# EAGLE schematic adapterSchematic (EAGLE 9.6.2)
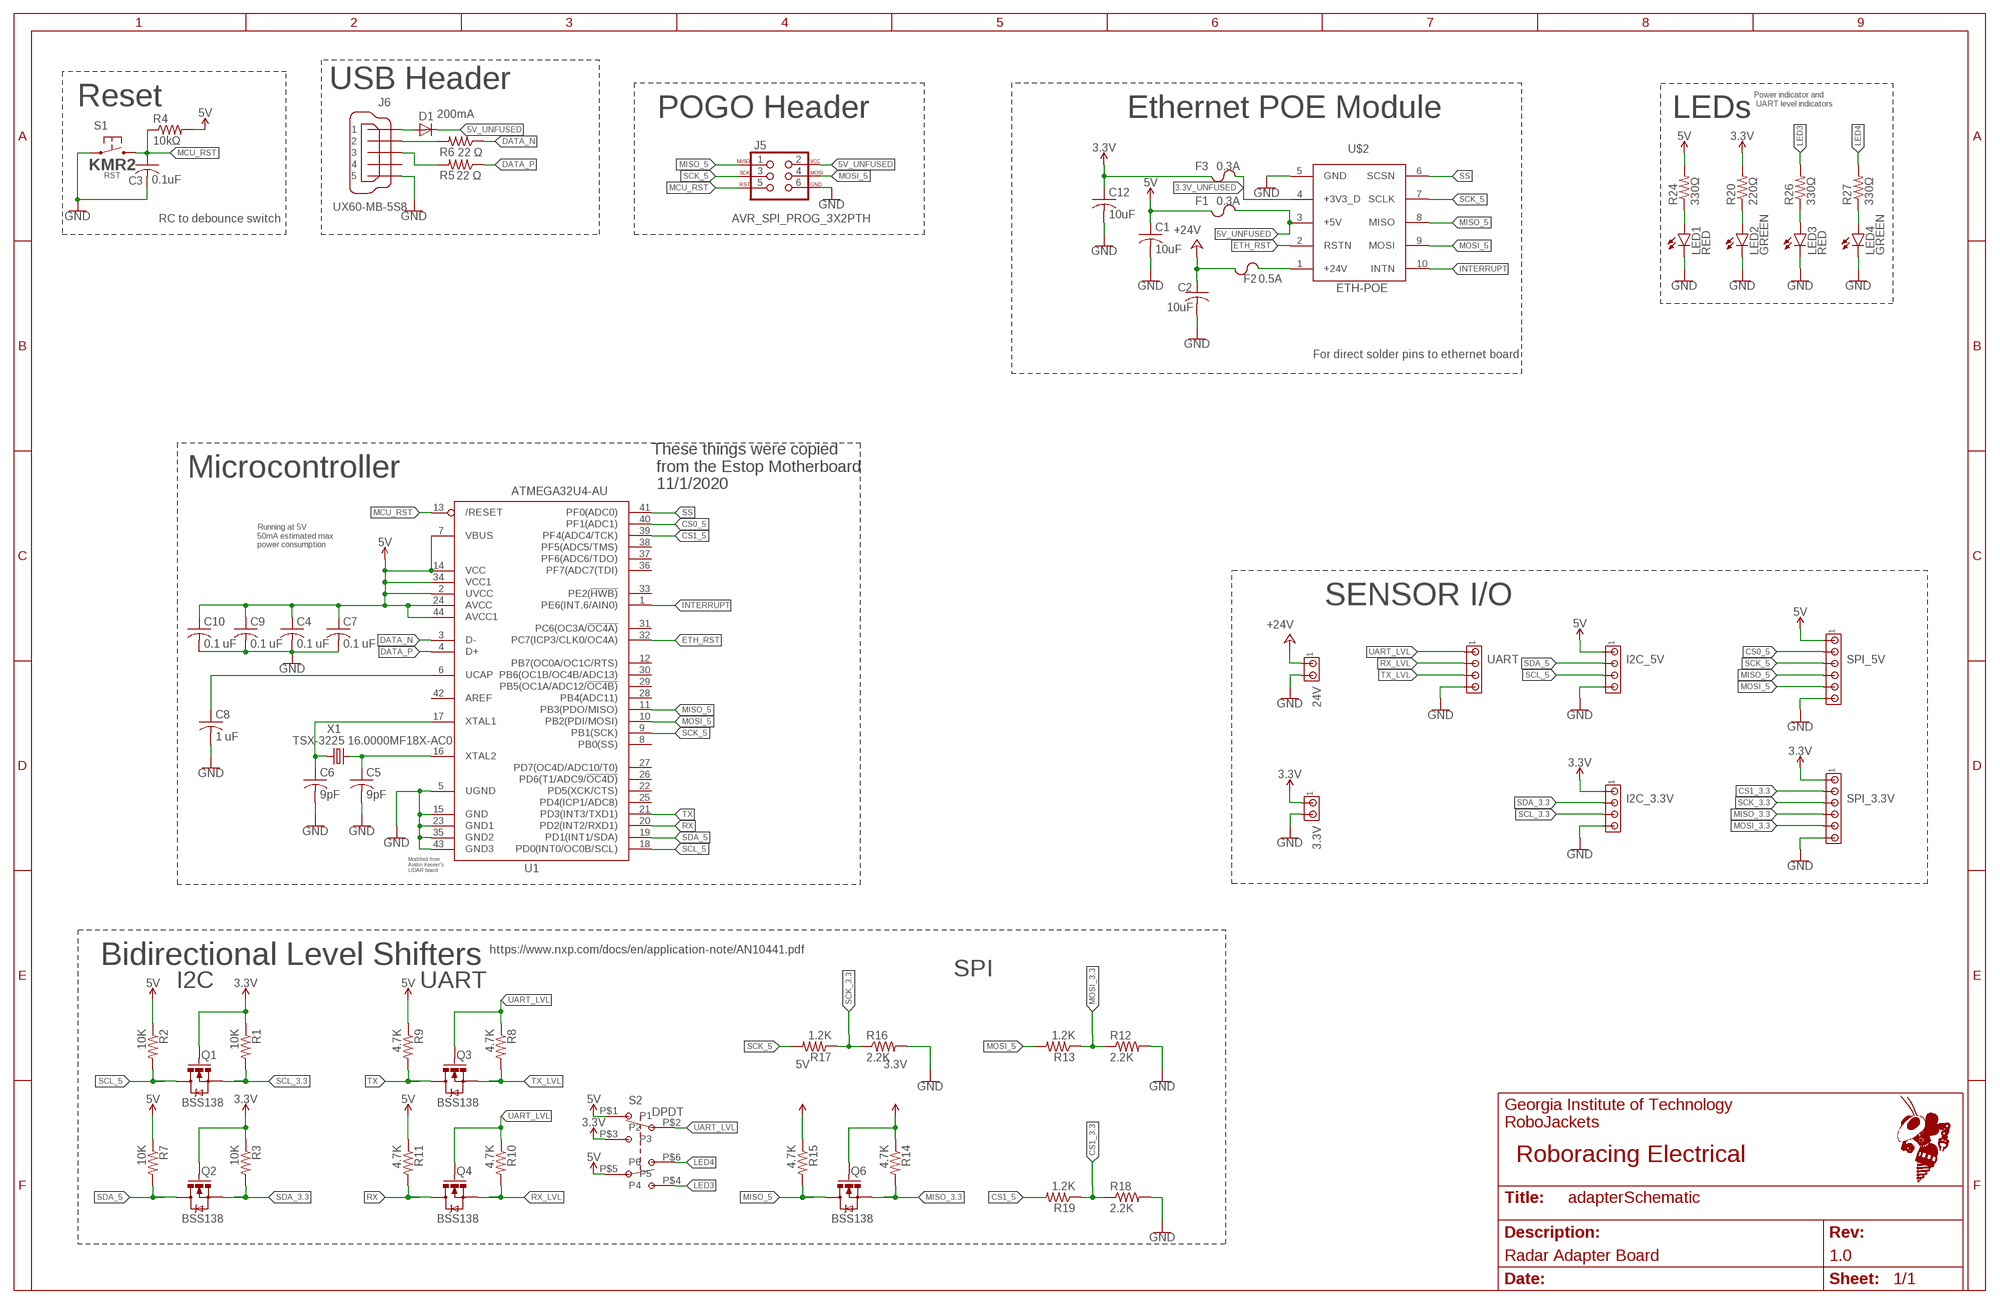
[diagram p0: schematic, sheet 1]
FRAME1 (FRAME_11_17): REVISION: 1.0; SCH_DESC: Radar Adapter Board; TEAM: Roboracing Electrical

## Parts
3.3V  MTA02-100  [10X02MTA]
24V  MTA02-100  [10X02MTA]
C1  10uF  C-USC1206  [C1206]
C2  10uF  C-USC1206  [C1206]
C3  0.1uF  C-USC0603  [C0603]
C4  0.1 uF  C-USC0603  [C0603]
C5  9pF  C-USC0603  [C0603]
C6  9pF  C-USC0603  [C0603]
C7  0.1 uF  C-USC0603  [C0603]
C8  1 uF  C-USC0603  [C0603]
C9  0.1 uF  C-USC0603  [C0603]
C10  0.1 uF  C-USC0603  [C0603]
C12  10uF  C-USC1206  [C1206]
D1  200mA  DIODE-SOD323-R  [SOD323-R]
F1  0.3A  CHIP_FUSE1206  [F1206]
F2  0.5A  CHIP_FUSE1206  [F1206]
F3  0.3A  CHIP_FUSE1206  [F1206]
I2C_3.3V  MTA04-100  [10X04MTA]
I2C_5V  MTA04-100  [10X04MTA]
J5  AVR_SPI_PROG_3X2PTH  [2X3]
J6  UX60-MB-5S8  [UX60-MB-5S8]
LED1  RED  LEDCHIP-LED0603  [CHIP-LED0603]
LED2  GREEN  LEDCHIP-LED0603  [CHIP-LED0603]
LED3  RED  LEDCHIP-LED0603  [CHIP-LED0603]
LED4  GREEN  LEDCHIP-LED0603  [CHIP-LED0603]
Q1  BSS138  MOSFET-NCHANNELSMD  [SOT23-3]
Q2  BSS138  MOSFET-NCHANNELSMD  [SOT23-3]
Q3  BSS138  MOSFET-NCHANNELSMD  [SOT23-3]
Q4  BSS138  MOSFET-NCHANNELSMD  [SOT23-3]
Q6  BSS138  MOSFET-NCHANNELSMD  [SOT23-3]
R1  10K  RESISTOR0603-RES  [0603-RES]
R2  10K  RESISTOR0603-RES  [0603-RES]
R3  10K  RESISTOR0603-RES  [0603-RES]
R4  10kΩ  R-US_R0603  [R0603]
R5  22 Ω  R-US_R0603  [R0603]
R6  22 Ω  R-US_R0603  [R0603]
R7  10K  RESISTOR0603-RES  [0603-RES]
R8  4.7K  RESISTOR0603-RES  [0603-RES]
R9  4.7K  RESISTOR0603-RES  [0603-RES]
R10  4.7K  RESISTOR0603-RES  [0603-RES]
R11  4.7K  RESISTOR0603-RES  [0603-RES]
R12  2.2K  RESISTOR0603-RES  [0603-RES]
R13  1.2K  RESISTOR0603-RES  [0603-RES]
R14  4.7K  RESISTOR0603-RES  [0603-RES]
R15  4.7K  RESISTOR0603-RES  [0603-RES]
R16  2.2K  RESISTOR0603-RES  [0603-RES]
R17  1.2K  RESISTOR0603-RES  [0603-RES]
R18  2.2K  RESISTOR0603-RES  [0603-RES]
R19  1.2K  RESISTOR0603-RES  [0603-RES]
R20  220Ω  R-US_R0603  [R0603]
R24  330Ω  R-US_R0603  [R0603]
R26  330Ω  R-US_R0603  [R0603]
R27  330Ω  R-US_R0603  [R0603]
S1  KMR2  [KMR2]
SPI_3.3V  MTA06-100  [10X06MTA]
SPI_5V  MTA06-100  [10X06MTA]
U1  ATMEGA32U4-AU  [TQFP44]
U$2  ETH-POE  [HDRVR10W64P4000X254_2X5_1016X508X254B]
U$4  DPDT_SLIDE_SWITCH  [DPDT_SLIDE_SWITCH]
UART  MTA04-100  [10X04MTA]
X1  TSX-3225 16.0000MF18X-AC0  XTAL-3.2X2.5  [XTAL-3.2X2.5]

## Nets
3.3V: 3.3V.1 C12.1 F3.1 I2C_3.3V.1 Q1.1(G) Q2.1(G) Q6.1(G) R1.1 R3.1 R14.1 R20.2 SPI_3.3V.1 U$4.P$3(P3)
3.3V_UNFUSED: F3.2 U$2.4(+3V3_D)
5V [power]: C1.1 C4.1 C7.1 C9.1 C10.1 F1.1 I2C_5V.1 R2.1 R4.2 R7.1 R9.1 R11.1 R15.1 R24.2 SPI_5V.1 U1.2(UVCC) U1.7(VBUS) U1.14(VCC) U1.24(AVCC) U1.34(VCC1) U1.44(AVCC1) U$4.P$1(P1) U$4.P$5(P5)
5V_UNFUSED [power]: D1.C F1.2 J5.2 U$2.3(+5V)
24V_UNFUSED: F2.2 U$2.1(+24V)
+24V: 24V.1 C2.1 F2.1
CS0_5: SPI_5V.2 U1.40(PF1(ADC1))
CS1_3.3: R18.1 R19.1 SPI_3.3V.2
CS1_5: R19.2 U1.39(PF4(ADC4/TCK))
DATA_N: R6.1 U1.3(D-)
DATA_P [RF]: R5.1 U1.4(D+)
ETH_RST: U1.32(PC7(ICP3/CLK0/OC4A)) U$2.2(RSTN)
GND [power]: 3.3V.2 24V.2 C1.2 C2.2 C3.2 C4.2 C5.2 C6.2 C7.2 C8.2 C9.2 C10.2 C12.2 I2C_3.3V.4 I2C_5V.4 J5.6 J6.5 LED1.C LED2.C LED3.C LED4.C R12.2 R16.2 R18.2 S1.1.1 S1.1.2 SPI_3.3V.6 SPI_5V.6 U1.5(UGND) U1.15(GND) U1.23(GND1) U1.35(GND2) U1.43(GND3) U$2.5(GND) UART.4
INTERRUPT: U1.1(PE6(INT.6/AIN0)) U$2.10(INTN)
LED3: R26.2 U$4.P$4(P4)
LED4: R27.2 U$4.P$6(P6)
MCU_RST: C3.1 J5.5 R4.1 S1.2.1 S1.2.2 U1.13(/RESET)
MISO_3.3: Q6.2(S) R14.2 SPI_3.3V.4
MISO_5: J5.1 Q6.3(D) R15.2 SPI_5V.4 U1.11(PB3(PDO/MISO)) U$2.8(MISO)
MOSI_3.3: R12.1 R13.1 SPI_3.3V.5
MOSI_5: J5.4 R13.2 SPI_5V.5 U1.10(PB2(PDI/MOSI)) U$2.9(MOSI)
N$1: LED2.A R20.1
N$3: LED1.A R24.1
N$4: LED3.A R26.1
N$5: J6.2 R6.2
N$7: D1.A J6.1
N$8: LED4.A R27.1
N$11: J6.3 R5.2
RX: Q4.3(D) R11.2 U1.20(PD2(INT2/RXD1))
RX_LVL: Q4.2(S) R10.2 UART.2
SCK_3.3: R16.1 R17.1 SPI_3.3V.3
SCK_5: J5.3 R17.2 SPI_5V.3 U1.9(PB1(SCK)) U$2.7(SCLK)
SCL_3.3: I2C_3.3V.3 Q1.2(S) R1.2
SCL_5: I2C_5V.3 Q1.3(D) R2.2 U1.18(PD0(INT0/OC0B/SCL))
SDA_3.3: I2C_3.3V.2 Q2.2(S) R3.2
SDA_5: I2C_5V.2 Q2.3(D) R7.2 U1.19(PD1(INT1/SDA))
SS: U1.41(PF0(ADC0)) U$2.6(SCSN)
TX: Q3.3(D) R9.2 U1.21(PD3(INT3/TXD1))
TX_LVL: Q3.2(S) R8.2 UART.3
UART_LVL: Q3.1(G) Q4.1(G) R8.1 R10.1 U$4.P$2(P2) UART.1
UCAP: C8.1 U1.6(UCAP)
XTAL1: C6.1 U1.17(XTAL1) X1.1
XTAL2: C5.1 U1.16(XTAL2) X1.3
Unconnected: J6.4 U1.8(PB0(SS)) U1.12(PB7(OC0A/OC1C/RTS)) U1.22(PD5(XCK/CTS)) U1.25(PD4(ICP1/ADC8)) U1.26(PD6(T1/ADC9/!OC4D)) U1.27(PD7(OC4D/ADC10/T0)) U1.28(PB4(ADC11)) U1.29(PB5(OC1A/ADC12/!OC4B)) U1.30(PB6(OC1B/OC4B/ADC13)) U1.31(PC6(OC3A/!OC4A)) U1.33(PE2(!HWB)) U1.36(PF7(ADC7(TDI)) U1.37(PF6(ADC6/TDO)) U1.38(PF5(ADC5/TMS)) U1.42(AREF)

## Notes on the sheet
- USB Header
- Reset
- Power indicator and
   UART level indicators
- POGO Header | Ethernet POE Module | LEDs
- RC to debounce switch
- For direct solder pins to ethernet board
- Microcontroller
- These things were copied
   from the Estop Motherboard 
   11/1/2020
- Running at 5V
  50mA estimated max
  power consumption
- SENSOR I/O
- Modified from 
  Austin Keener's 
  LIDAR board
- https://www.nxp.com/docs/en/application-note/AN10441.pdf
- Bidirectional Level Shifters
- SPI
- I2C | UART
- S2

## Library data of the parts
3.3V 24V = con-amp:MTA02-100: AMP connector
C1-C3 C12 = rcl:C-US: CAPACITOR, American symbol; SPICEPREFIX: C
C4-C10 = resistor:C-US: CAPACITOR, American symbol
D1 = RoboJackets-Diodes:DIODE-: DIODE
F1-F3 = RoboJackets-Fuses:CHIP_FUSE
I2C_3.3V I2C_5V UART = con-amp:MTA04-100: AMP connector
J5 = SparkFun-Connectors:AVR_SPI_PROG_3X2: AVR ISP 6 Pin This is the reduced ISP connector for AVR programming. Common on Arduino. This footprint will take up less PCB space and can be used with a 10-pin to 6-pin adapter such as SKU: BOB-08508 **Special note about "TEST_POINT" package. The stop mask is on the top side, so if you want your programming test points to be on the bottom of your board, make sure to place this package on the bottom side of the board. This also ensure that the orientation to program from the bottom side will be correct. SparkFun Products: SparkFun ISP Pogo Adapter <https://www.sparkfun.com/products/11591> - NS Tiny AVR Programmer <https://www.sparkfun.com/products/11801> -PTH
J6 = RoboJackets-Connectors:UX60*-MB-5S?: Mini USB Connector Brand: Hirose Electric Co Ltd <http://www.hirose.com/us/> Series: UX <http://www.digikey.com/product-search/en?FV=fff40016,fff802e4,ffec3225> Distributor: Digi-Key <http://www.digikey.com/product-detail/en/UX60A-MB-5ST/H2961CT-ND/597540>; PINS: 5
LED1-LED4 = led:LED: LED OSRAM: - CHIPLED LG R971, LG N971, LY N971, LG Q971, LY Q971, LO R971, LY R971 LH N974, LH R974 LS Q976, LO Q976, LY Q976 LO Q996 - Hyper CHIPLED LW Q18S LB Q993, LB Q99A, LB R99A - SideLED LS A670, LO A670, LY A670, LG A670, LP A670 LB A673, LV A673, LT A673, LW A673 LH A674 LY A675 LS A676, LA A676, LO A676, LY A676, LW A676 LS A679, LY A679, LG A679 - Hyper Micro SIDELED® LS Y876, LA Y876, LO Y876, LY Y876 LT Y87S - SmartLED LW L88C, LW L88S LB L89C, LB L89S, LG L890 LS L89K, LO L89K, LY L89K LS L896, LA L896, LO L896, LY L896 - TOPLED LS T670, LO T670, LY T670, LG T670, LP T670 LSG T670, LSP T670, LSY T670, LOP T670, LYG T670 LG T671, LOG T671, LSG T671 LB T673, LV T673, LT T673, LW T673 LH T674 LS T676, LA T676, LO T676, LY T676, LB T676, LH T676, LSB T676, LW T676 LB T67C, LV T67C, LT T67C, LS T67K, LO T67K, LY T67K, LW E67C LS E67B, LA E67B, LO E67B, LY E67B, LB E67C, LV E67C, LT E67C LW T67C LS T679, LY T679, LG T679 LS T770, LO T770, LY T770, LG T770, LP T770 LB T773, LV T773, LT T773, LW T773 LH T774 LS E675, LA E675, LY E675, LS T675 LS T776, LA T776, LO T776, LY T776, LB T776 LHGB T686 LT T68C, LB T68C - Hyper Mini TOPLED® LB M676 - Mini TOPLED Santana® LG M470 LS M47K, LO M47K, LY M47K Source: http://www.osram.convergy.de LUXEON: - LUMILED® LXK2-PW12-R00, LXK2-PW12-S00, LXK2-PW14-U00, LXK2-PW14-V00 LXK2-PM12-R00, LXK2-PM12-S00, LXK2-PM14-U00 LXK2-PE12-Q00, LXK2-PE12-R00, LXK2-PE12-S00, LXK2-PE14-T00, LXK2-PE14-U00 LXK2-PB12-K00, LXK2-PB12-L00, LXK2-PB12-M00, LXK2-PB14-N00, LXK2-PB14-P00, LXK2-PB14-Q00 LXK2-PR12-L00, LXK2-PR12-M00, LXK2-PR14-Q00, LXK2-PR14-R00 LXK2-PD12-Q00, LXK2-PD12-R00, LXK2-PD12-S00 LXK2-PH12-R00, LXK2-PH12-S00 LXK2-PL12-P00, LXK2-PL12-Q00, LXK2-PL12-R00 Source: www.luxeon.com KINGBRIGHT: KA-3528ASYC Source: www.kingbright.com
Q1-Q4 Q6 = SparkFun:MOSFET-NCHANNEL
R1-R3 R7-R19 = SparkFun:RESISTOR: Resistor Basic schematic elements and footprints for 0603, 1206, and PTH resistors.
R4-R6 R20 R24 R26 R27 = rcl:R-US_: RESISTOR, American symbol; SPICEPREFIX: R
S1 = RoboJackets-Switches:KMR2; FUNCTION: RST
SPI_3.3V SPI_5V = con-amp:MTA06-100: AMP connector Connection corrected 2014-09-19
U1 = estop-v1.0:ATMEGA32U4: http://www.ladyada.net/library/eagle
U$2 = ethernet_poe:ETH-POE: POE
U$4 = DPDT-slide-switch:DPDT_SLIDE_SWITCH
X1 = RoboJackets-FreqGen:XTAL

## Net classes
0 default: width 0.203 mm, drill 0.508 mm, clearance 0.178 mm
1 power: width 0.305 mm, drill 0.508 mm, clearance 0.178 mm
2 RF: width 0.203 mm, clearance 0.178 mm